# EAGLE schematic LSA-PCB 4xSerial+Analog (EAGLE 7.6.0)
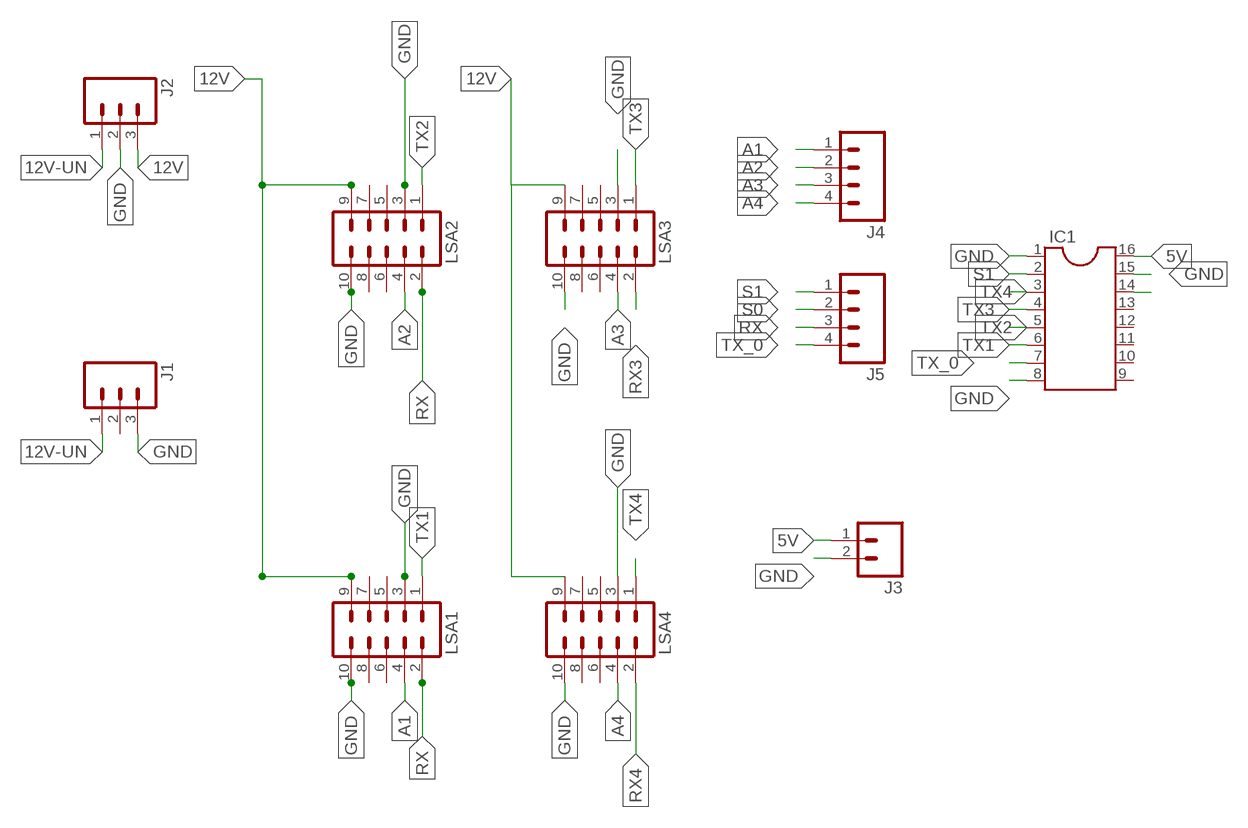
[diagram p0: schematic, sheet 1]

## Parts
IC1  DIL16S  [SOCKET-16]
J1  M03PTH  [1X03]
J2  M03PTH  [1X03]
J3  M02PTH  [1X02]
J4  M04PTH  [1X04]
J5  M04PTH  [1X04]
LSA1  M05X2SHD_LOCK  [2X5-SHROUDED_LOCK]
LSA2  M05X2SHD_LOCK  [2X5-SHROUDED_LOCK]
LSA3  M05X2SHD_LOCK  [2X5-SHROUDED_LOCK]
LSA4  M05X2SHD_LOCK  [2X5-SHROUDED_LOCK]

## Nets
5V: IC1.16 J3.1
12V: J2.3 LSA1.9 LSA2.9 LSA3.9 LSA4.9
12V-UN: J1.1 J2.1
A1: J4.1 LSA1.4
A2: J4.2 LSA2.4
A3: J4.3 LSA3.4
A4: J4.4 LSA4.4
GND: IC1.1 IC1.8 IC1.15 J1.3 J2.2 J3.2 LSA1.3 LSA1.10 LSA2.3 LSA2.10 LSA3.3 LSA3.10 LSA4.3 LSA4.10
RX: J5.3 LSA1.2 LSA2.2
RX3: LSA3.2
RX4: LSA4.2
S0: IC1.14 J5.2
S1: IC1.2 J5.1
TX1: IC1.6 LSA1.1
TX2: IC1.5 LSA2.1
TX3: IC1.4 LSA3.1
TX4: IC1.3 LSA4.1
TX_0: IC1.7 J5.4
Unconnected: IC1.9 IC1.10 IC1.11 IC1.12 IC1.13 J1.2 LSA1.5 LSA1.6 LSA1.7 LSA1.8 LSA2.5 LSA2.6 LSA2.7 LSA2.8 LSA3.5 LSA3.6 LSA3.7 LSA3.8 LSA4.5 LSA4.6 LSA4.7 LSA4.8

## Library data of the parts
IC1 = ic-package:DIL16: Dual In Line / Socket
J1 J2 = SparkFun-Connectors:M03: Header 3 Standard 3-pin 0.1" header. Use with straight break away headers (SKU : PRT-00116), right angle break away headers (PRT-00553), swiss pins (PRT-00743), machine pins (PRT-00117), and female headers (PRT-00115). Molex polarized connector foot print use with SKU : PRT-08232 with associated crimp pins and housings.
J3 = SparkFun-Connectors:M02: Standard 2-pin 0.1" header. Use with - straight break away headers ( PRT-00116) - right angle break away headers (PRT-00553) - swiss pins (PRT-00743) - machine pins (PRT-00117) - female headers (PRT-00115) Molex polarized connector foot print use with: PRT-08233 with associated crimp pins and housings. 2.54_SCREWTERM for use with PRT-10571. 3.5mm Screw Terminal footprints for PRT-08084 5mm Screw Terminal footprints for use with PRT-08432
J4 J5 = SparkFun-Connectors:M04: Header 4 Standard 4-pin 0.1" header. Use with straight break away headers (SKU : PRT-00116), right angle break away headers (PRT-00553), swiss pins (PRT-00743), machine pins (PRT-00117), and female headers (PRT-00115). Molex polarized connector foot print use with SKU : PRT-08231 with associated crimp pins and housings. 1MM SMD Version SKU: PRT-10208; PROD_ID: CONN-09696
LSA1-LSA4 = SparkFun-Connectors:M05X2: Header 5x2 Standard 10-pin dual row 0.1" header. Commonly used with AVR-ISP. Use with Spark Fun Electronics SKU: PRT-00778